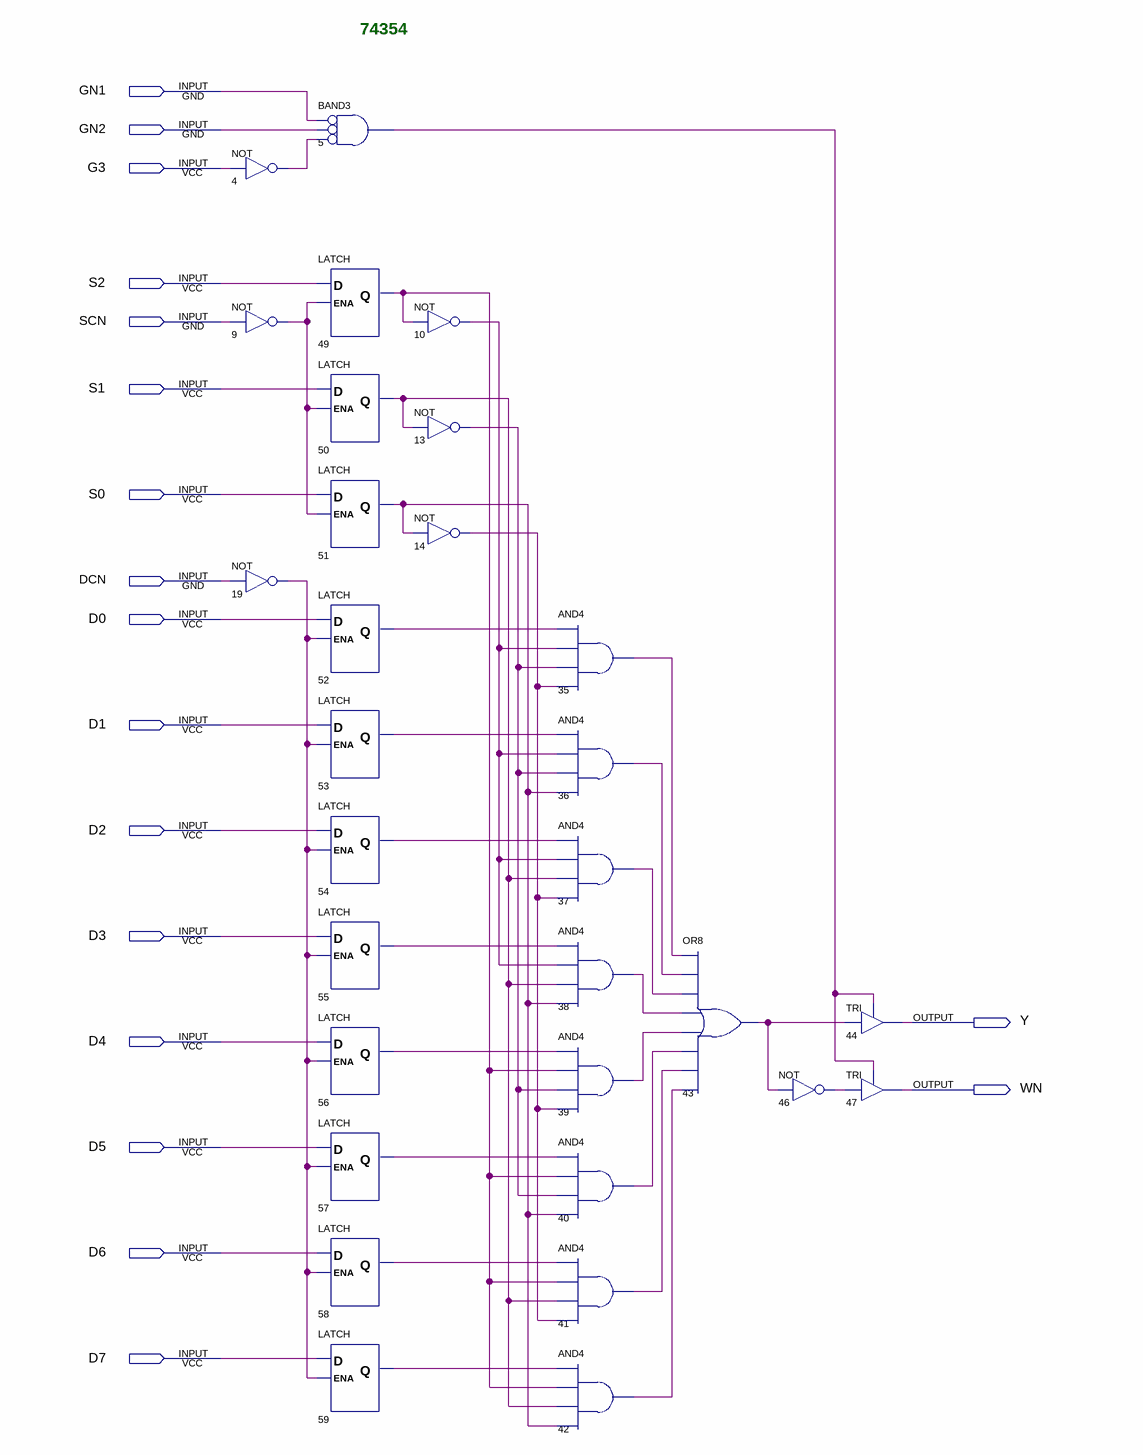
[diagram p0: schematic sheet]
// Quartus schematic 74354.bdf as structural Verilog: 30 symbols, 18 pins
module \74354  (
  input  GN1,
  input  GN2,
  input  G3,
  input  S2,
  input  SCN,
  input  S1,
  input  S0,
  input  DCN,
  input  D0,
  input  D1,
  input  D2,
  input  D3,
  input  D4,
  input  D5,
  input  D6,
  input  D7,
  output Y,
  output WN
);

  wire n4_out, n5_out, n9_out, n10_out, n13_out, n14_out, n19_out, n35_out, n36_out, n37_out, n38_out,
       n39_out, n40_out, n41_out, n42_out, n43_out, n46_out, n49_q, n50_q, n51_q, n52_q, n53_q, n54_q, n55_q,
       n56_q, n57_q, n58_q, n59_q;

  not u_4 (n4_out, G3);
  not u_9 (n9_out, SCN);
  not u_19 (n19_out, DCN);
  and u_5 (n5_out, ~GN1, ~GN2, ~n4_out);  // BAND3
  LATCH u_49 (.D(S2), .ENA(n9_out), .Q(n49_q));
  LATCH u_50 (.D(S1), .ENA(n9_out), .Q(n50_q));
  LATCH u_51 (.D(S0), .ENA(n9_out), .Q(n51_q));
  LATCH u_52 (.D(D0), .ENA(n19_out), .Q(n52_q));
  LATCH u_53 (.D(D1), .ENA(n19_out), .Q(n53_q));
  LATCH u_54 (.D(D2), .ENA(n19_out), .Q(n54_q));
  LATCH u_55 (.D(D3), .ENA(n19_out), .Q(n55_q));
  LATCH u_56 (.D(D4), .ENA(n19_out), .Q(n56_q));
  LATCH u_57 (.D(D5), .ENA(n19_out), .Q(n57_q));
  LATCH u_58 (.D(D6), .ENA(n19_out), .Q(n58_q));
  LATCH u_59 (.D(D7), .ENA(n19_out), .Q(n59_q));
  not u_10 (n10_out, n49_q);
  not u_13 (n13_out, n50_q);
  not u_14 (n14_out, n51_q);
  and u_35 (n35_out, n52_q, n10_out, n13_out, n14_out);
  and u_36 (n36_out, n53_q, n10_out, n13_out, n51_q);
  and u_37 (n37_out, n54_q, n10_out, n50_q, n14_out);
  and u_38 (n38_out, n55_q, n10_out, n50_q, n51_q);
  and u_39 (n39_out, n56_q, n49_q, n13_out, n14_out);
  and u_40 (n40_out, n57_q, n49_q, n13_out, n51_q);
  and u_41 (n41_out, n58_q, n49_q, n50_q, n14_out);
  and u_42 (n42_out, n59_q, n49_q, n50_q, n51_q);
  or u_43 (n43_out, n35_out, n36_out, n37_out, n38_out, n39_out, n40_out, n41_out, n42_out);
  not u_46 (n46_out, n43_out);
  TRI u_44 (.IN(n43_out), .OE(n5_out), .OUT(Y));
  TRI u_47 (.IN(n46_out), .OE(n5_out), .OUT(WN));

  // Notes on the sheet:
  //   74354
endmodule
